# EAGLE schematic adc_spi_esp12E (EAGLE 9.2.2)

## Sheet 1 of 2
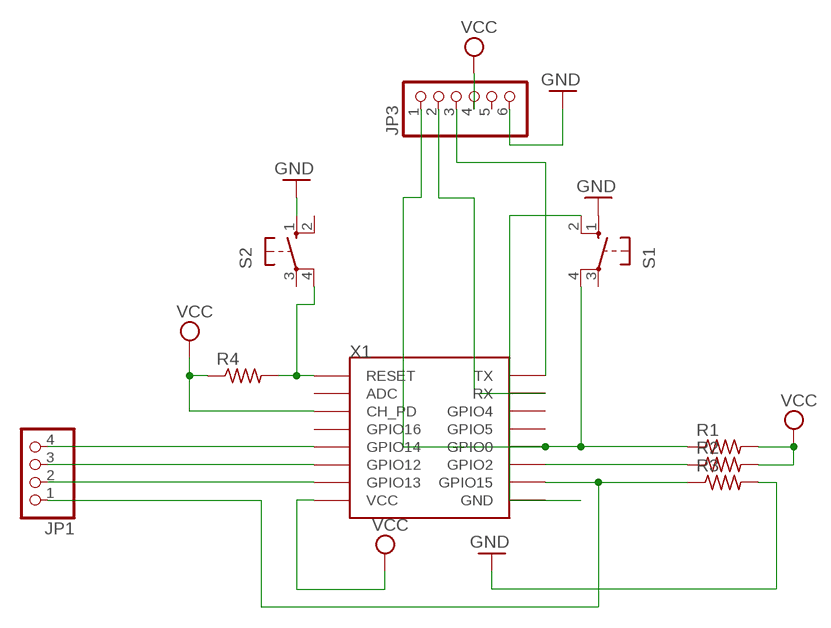
[diagram p0: schematic, sheet 1]

### Parts
JP1  PINHD-1X4  [1X04]
JP3  PINHD-1X6B  [1X06-BIG]
R1  R-US_0204/7  [0204/7]
R2  R-US_0204/7  [0204/7]
R3  R-US_0204/7  [0204/7]
R4  R-US_0204/5  [0204/5]
S1  10-XX  [B3F-10XX]
S2  10-XX  [B3F-10XX]
X1  ESP12SMD  [ESP12-SMD]

### Nets
GND: JP3.6 R3.2 S1.1(S) S2.1(S)
N$2: S1.2(S1) X1.GND
N$3: R2.1 X1.GPIO2
N$7: JP1.3 X1.GPIO12
N$8: R4.2 S2.4(P1) X1.RESET
N$9: JP1.2 X1.GPIO13
N$10: JP3.1 R1.1 S1.4(P1) X1.GPIO0
N$11: JP3.3 X1.TXD0(TX)
N$12: JP1.1 R3.1 X1.GPIO15
N$13: JP3.2 X1.RXD0(RX)
N$14: JP1.4 X1.GPIO14
VCC: JP3.4 R1.2 R2.2 R4.1 X1.CH_PD X1.VCC
Unconnected: JP3.5 S1.3(P) S2.2(S1) S2.3(P) X1.ADC X1.GPIO4 X1.GPIO5 X1.GPIO16

## Sheet 2 of 2

## Library data of the parts
JP1 = pinhead:PINHD-1X4: PIN HEADER
JP3 = adafruit:PINHD-1X6: PIN HEADER
R1-R4 = resistor:R-US_: RESISTOR, American symbol
S1 S2 = switch-omron:10-XX: OMRON SWITCH; MPN: B3F-1000; OC_FARNELL: 176432; OC_NEWARK: 36M3542
X1 = esp8266modules:ESP12: ESP8266 Wifi module 12

## Net classes
0 default: width 0.254 mm, clearance 0.254 mm